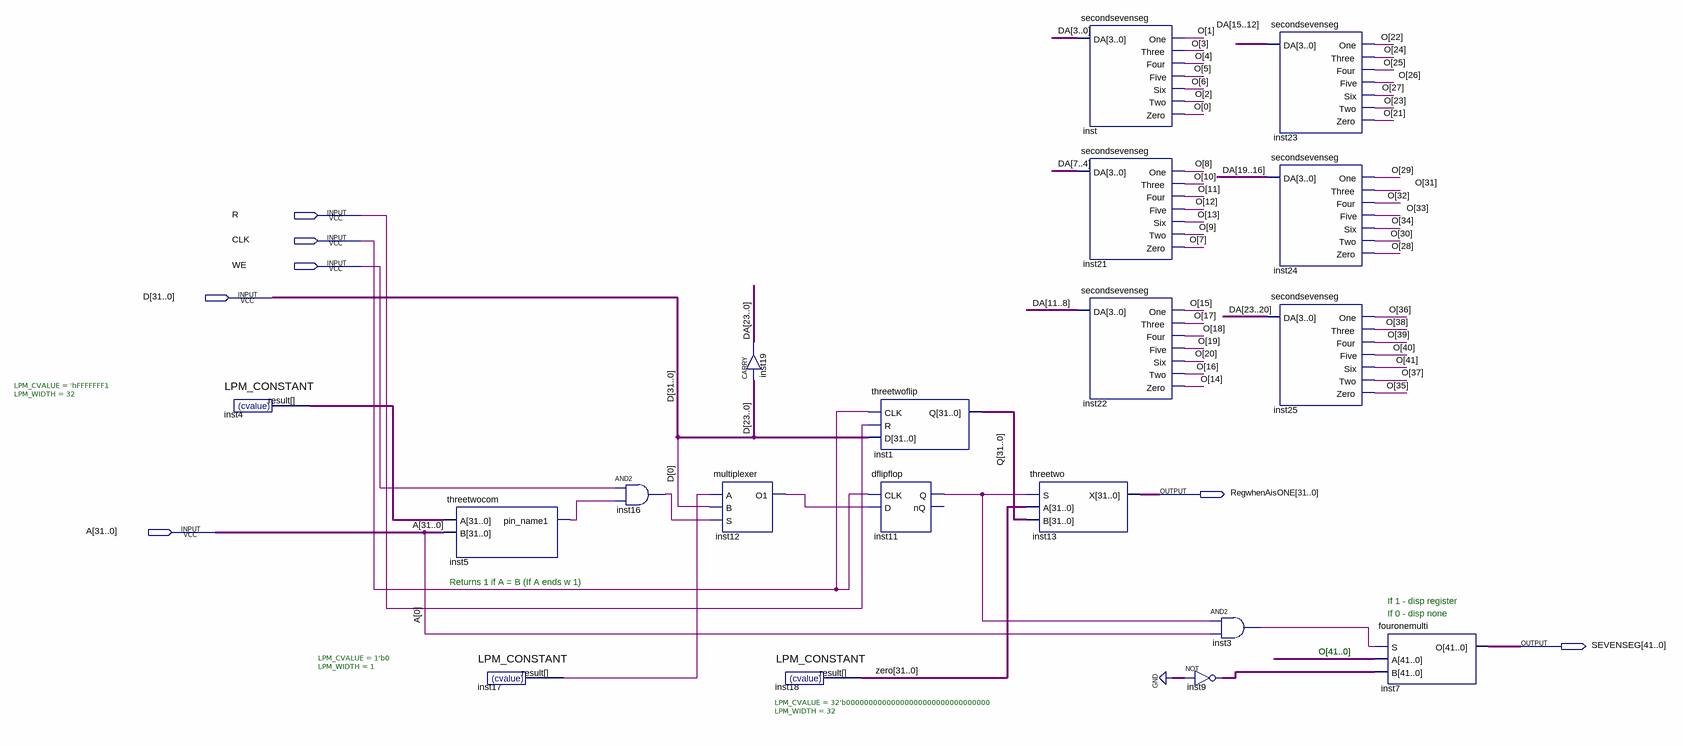
[diagram p0: schematic sheet]
// Quartus schematic sourcethree.bdf as structural Verilog: 19 symbols, 7 pins
module sourcethree (
  input  R,
  input  CLK,
  input  WE,
  input  [31:0] D,
  input  [31:0] A,
  output [31:0] RegwhenAisONE,
  output [41:0] SEVENSEG
);

  wire inst3_out, inst5_pin_name1, inst11_q, inst12_o1, inst16_out, inst17_result;
  wire [23:0] DA;
  wire [31:0] inst4_result, Q, zero;
  wire [41:0] inst9_out, O;

  LPM_CONSTANT #(.LPM_CVALUE('hFFFFFFF1), .LPM_WIDTH(32)) inst4 (.result(inst4_result));
  threetwocom inst5 (.A(inst4_result), .B(A), .pin_name1(inst5_pin_name1));
  LPM_CONSTANT #(.LPM_CVALUE(1'b0), .LPM_WIDTH(1)) inst17 (.result(inst17_result));
  and inst16 (inst16_out, WE, inst5_pin_name1);
  multiplexer inst12 (.A(inst17_result), .B(D[0]), .S(inst16_out), .O1(inst12_o1));
  CARRY inst19[23:0] (.IN(D[23:0]), .OUT(DA));
  LPM_CONSTANT #(.LPM_CVALUE(32'b00000000000000000000000000000000), .LPM_WIDTH(32)) inst18 (.result(zero));
  threetwoflip inst1 (.CLK(CLK), .R(R), .D(D), .Q(Q));
  dflipflop inst11 (.CLK(CLK), .D(inst12_o1), .Q(inst11_q));  // open: nQ
  threetwo inst13 (.S(inst11_q), .A(zero), .B(Q), .X(RegwhenAisONE));
  secondsevenseg inst (
    .DA(DA[3:0]), .One(O[1]), .Three(O[3]), .Four(O[4]), .Five(O[5]), .Six(O[6]), .Two(O[2]), .Zero(O[0]));
  secondsevenseg inst21 (
    .DA(DA[7:4]), .One(O[8]), .Three(O[10]), .Four(O[11]), .Five(O[12]), .Six(O[13]), .Two(O[9]), .Zero(O[7]));
  secondsevenseg inst22 (
    .DA(DA[11:8]), .One(O[15]), .Three(O[17]), .Four(O[18]), .Five(O[19]), .Six(O[20]), .Two(O[16]),
    .Zero(O[14]));
  and inst3 (inst3_out, inst11_q, A[0]);
  assign inst9_out = ~{42{1'b0}};  // NOT inst9, 42 bits wide
  secondsevenseg inst23 (
    .DA(DA[15:12]), .One(O[22]), .Three(O[24]), .Four(O[25]), .Five(O[26]), .Six(O[27]), .Two(O[23]),
    .Zero(O[21]));
  secondsevenseg inst24 (
    .DA(DA[19:16]), .One(O[29]), .Three(O[31]), .Four(O[32]), .Five(O[33]), .Six(O[34]), .Two(O[30]),
    .Zero(O[28]));
  secondsevenseg inst25 (
    .DA(DA[23:20]), .One(O[36]), .Three(O[38]), .Four(O[39]), .Five(O[40]), .Six(O[41]), .Two(O[37]),
    .Zero(O[35]));
  fouronemulti inst7 (.S(inst3_out), .A(O), .B(inst9_out), .O(SEVENSEG));

  // Notes on the sheet:
  //   Returns 1 if A = B (If A ends w 1)
  //   If 1 - disp register
  //   If 0 - disp none
  //   O[41..0]
endmodule
